# Altium schematic sheet Sheet1.SchDoc
size A; SheetNumber: 1; SheetTotal: 1
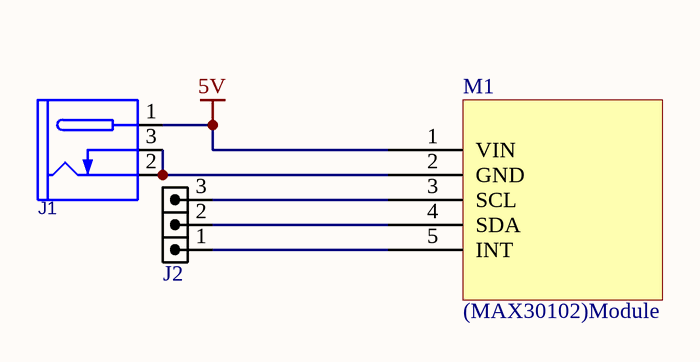
[diagram p0: Sheet1.SchDoc]

## Parts
J1  DC_POWER_JACK  [JAC_PWR1]  (value not drawn)
J2  HDRM3  [HDR_M_1X3]  (value not drawn)
M1  (MAX30102)Module  [MODULE-MAX30102]

## Nets
5V: J1.1(TIP) M1.1(VIN)
NetJ1_2: J1.2(SLEEVE) J1.3(INSERTION_DET) M1.2(GND)
NetJ2_1: J2.1 M1.5(INT)
NetJ2_2: J2.2 M1.4(SDA)
NetJ2_3: J2.3 M1.3(SCL)

## Library data of the parts
J1 = CONN_PWR_JACKR1: CONN, PWR JACK DC, PLUG DIAM 1.0MM RA THD; MANF: CUI STACK; MANF_P#: PJ-031CH, PJ-031C; PARAM: CH 3A, C 2A; VALUE: DC_POWER_JACK
J2 = HDR_M_1X3: CONN, HEADER, Male, pitch: 2.54mm, 3POS; VALUE: HDRM3
M1 = MODULE-MAX30102: Heart Rate Sensor Module (MAX30102)